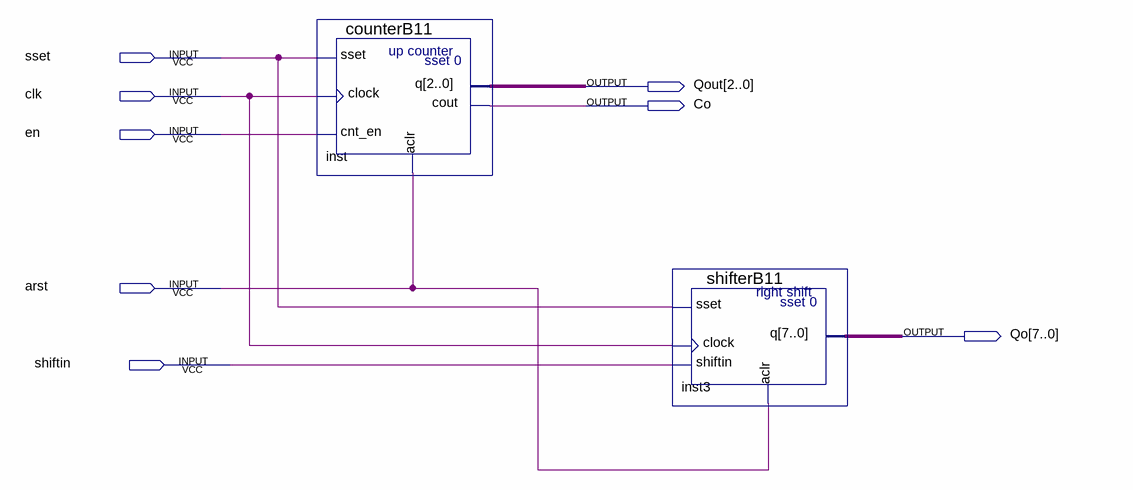
[diagram p0: schematic sheet]
// Quartus schematic upcounter.bdf as structural Verilog: 2 symbols, 8 pins
module upcounter (
  input  sset,
  input  clk,
  input  en,
  input  arst,
  input  shiftin,
  output [2:0] Qout,
  output Co,
  output [7:0] Qo
);

  counterB11 inst (.sset(sset), .clock(clk), .cnt_en(en), .aclr(arst), .cout(Co), .q(Qout));
  shifterB11 inst3 (.sset(sset), .clock(clk), .shiftin(shiftin), .aclr(arst), .q(Qo));
endmodule
